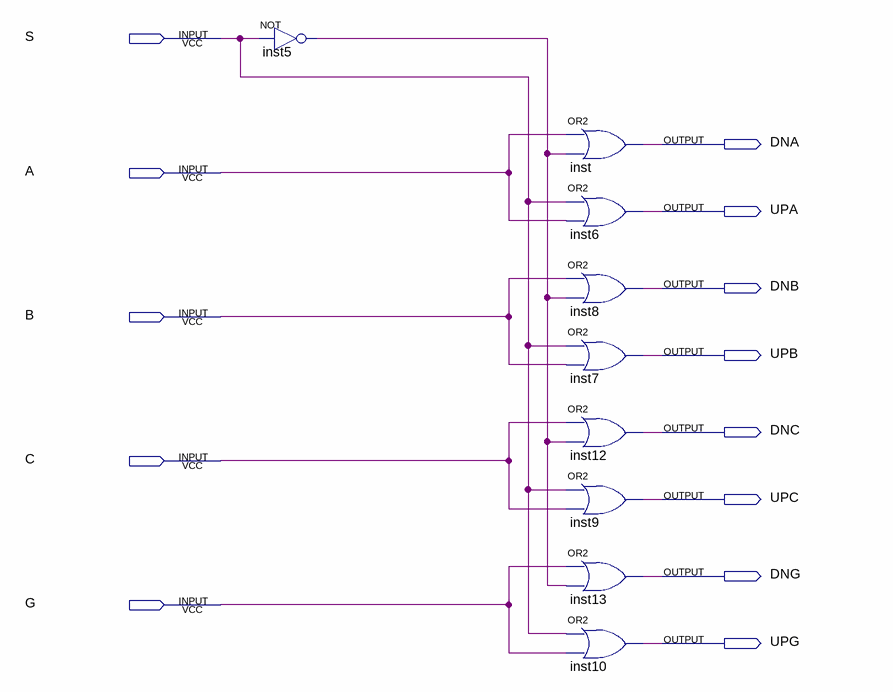
[diagram p0: schematic sheet]
// Quartus schematic demultiplexador_8.bdf as structural Verilog: 9 symbols, 13 pins
module demultiplexador_8 (
  input  S,
  input  A,
  input  B,
  input  C,
  input  G,
  output DNA,
  output UPA,
  output DNB,
  output UPB,
  output DNC,
  output UPC,
  output DNG,
  output UPG
);

  wire inst5_out;

  not inst5 (inst5_out, S);
  or inst (DNA, A, inst5_out);
  or inst6 (UPA, S, A);
  or inst8 (DNB, B, inst5_out);
  or inst7 (UPB, S, B);
  or inst12 (DNC, C, inst5_out);
  or inst9 (UPC, S, C);
  or inst13 (DNG, G, inst5_out);
  or inst10 (UPG, S, G);
endmodule
